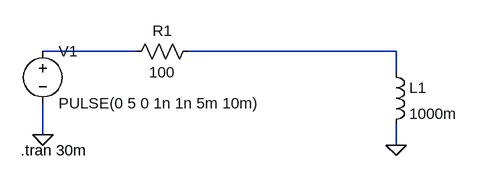
[diagram p0: schematic RL-filter.asc]
RL-filter.asc, the LTspice schematic file:
Version 4
SHEET 1 880 680
WIRE 64 80 -80 80
WIRE 464 80 144 80
WIRE 464 112 464 80
WIRE -80 208 -80 160
WIRE 464 224 464 192
FLAG -80 208 0
FLAG 464 224 0
SYMBOL voltage -80 64 R0
WINDOW 123 0 0 Left 0
WINDOW 39 0 0 Left 0
SYMATTR InstName V1
SYMATTR Value PULSE(0 5 0 1n 1n 5m 10m)
SYMBOL res 160 64 R90
WINDOW 0 0 56 VBottom 2
WINDOW 3 32 56 VTop 2
SYMATTR InstName R1
SYMATTR Value 100
SYMBOL ind 448 96 R0
SYMATTR InstName L1
SYMATTR Value 1000m
TEXT -114 232 Left 2 !.tran 30m

The netlist it stands for:
* RL-filter.asc
V1 N001 0 PULSE(0 5 0 1n 1n 5m 10m)
R1 N002 N001 100
L1 N002 0 1000m
.tran 30m
.backanno
.end